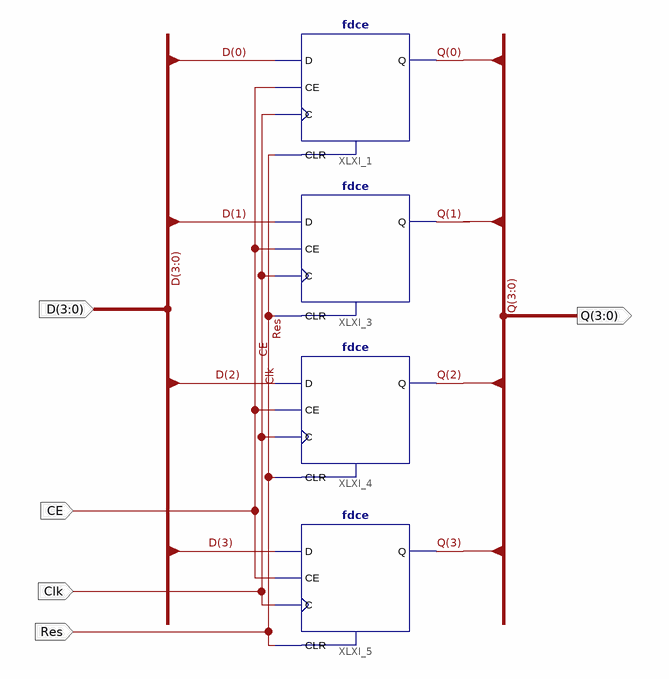
[diagram p0: schematic sheet 1]
// Xilinx ISE schematic reg4.sch (spartan3e) as structural Verilog: 4 symbols, 5 ports
module reg4 (
  input  Res,
  input  Clk,
  input  CE,
  input  [3:0] D,
  output [3:0] Q
);

  fdce XLXI_1 (.C(Clk), .CE(CE), .CLR(Res), .D(D[0]), .Q(Q[0]));
  fdce XLXI_3 (.C(Clk), .CE(CE), .CLR(Res), .D(D[1]), .Q(Q[1]));
  fdce XLXI_4 (.C(Clk), .CE(CE), .CLR(Res), .D(D[2]), .Q(Q[2]));
  fdce XLXI_5 (.C(Clk), .CE(CE), .CLR(Res), .D(D[3]), .Q(Q[3]));
endmodule
